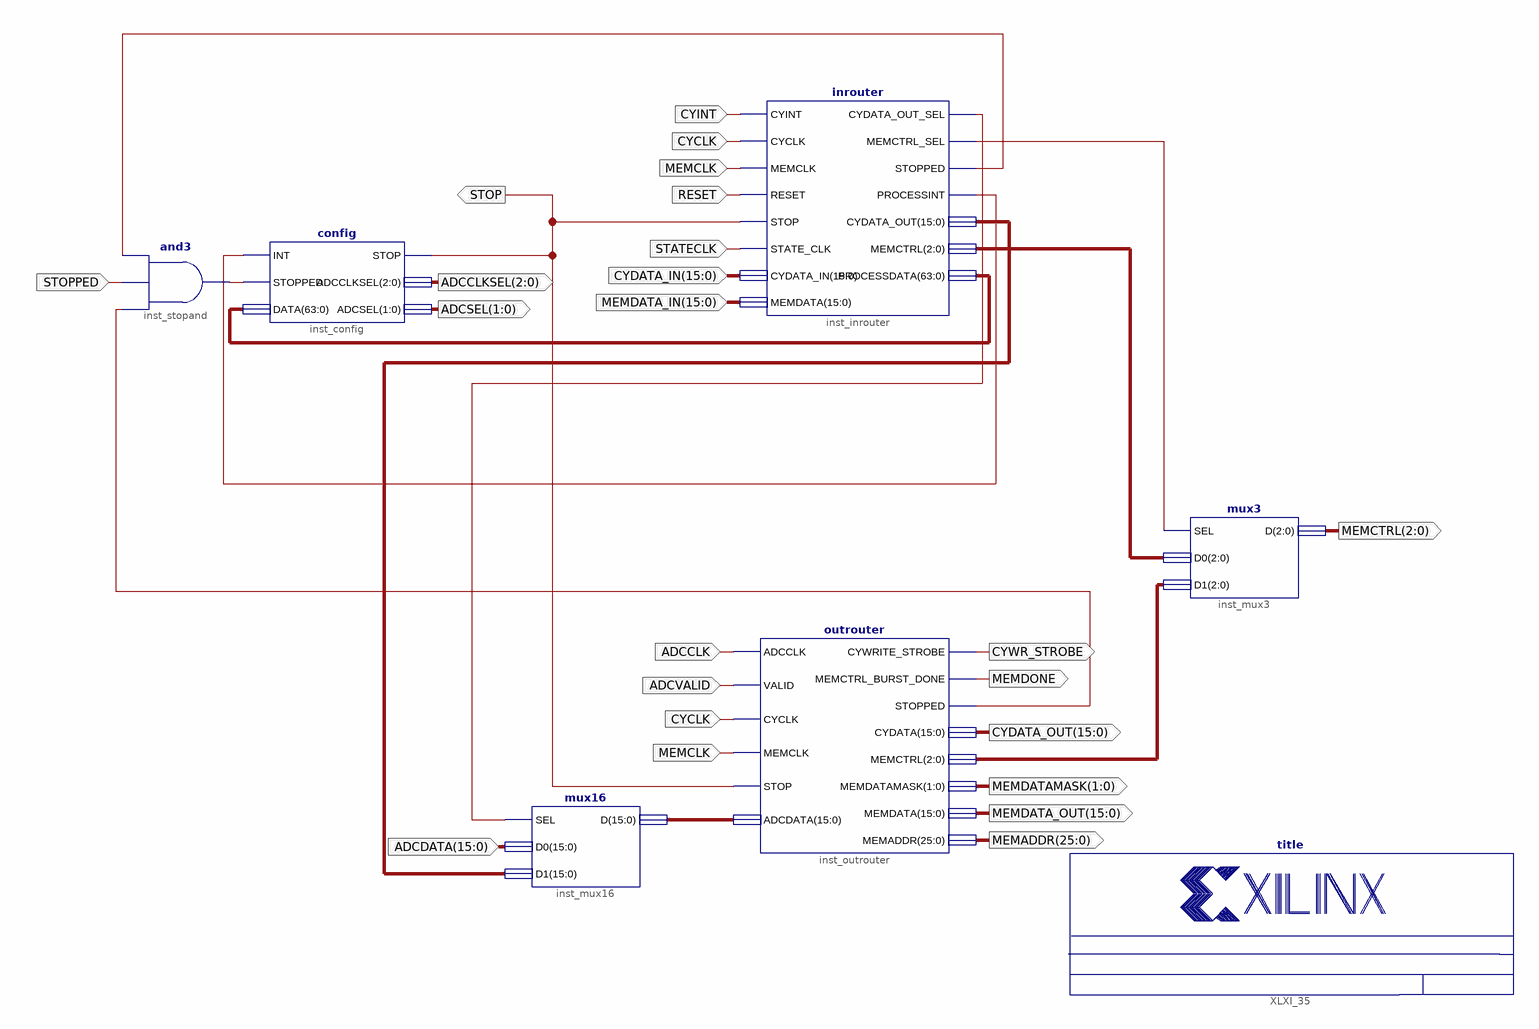
[diagram p0: schematic sheet 1]
// Xilinx ISE schematic processor.sch (spartan3a) as structural Verilog: 7 symbols, 21 ports
module processor (
  input  CYCLK,
  input  STATECLK,
  input  CYINT,
  input  [15:0] MEMDATA_IN,
  input  STOPPED,
  input  [15:0] CYDATA_IN,
  input  ADCCLK,
  input  ADCVALID,
  input  [15:0] ADCDATA,
  input  MEMCLK,
  input  RESET,
  output [1:0] ADCSEL,
  output [2:0] ADCCLKSEL,
  output [2:0] MEMCTRL,
  output STOP,
  output [25:0] MEMADDR,
  output [1:0] MEMDATAMASK,
  output [15:0] MEMDATA_OUT,
  output [15:0] CYDATA_OUT,
  output CYWR_STROBE,
  output MEMDONE
);

  wire XLXN_3, XLXN_22, XLXN_77, XLXN_85, XLXN_193, XLXN_202;
  wire [2:0] XLXN_74, XLXN_75;
  wire [15:0] XLXN_1, XLXN_224;
  wire [63:0] XLXN_223;

  title #(.TitleFieldText("USB Scope"), .NameFieldText("(C) Ali Lown 2010-11")) XLXI_35 ();
  inrouter inst_inrouter (
    .CYINT(CYINT), .CYCLK(CYCLK), .MEMCLK(MEMCLK), .RESET(RESET), .STOP(STOP), .STATE_CLK(STATECLK),
    .CYDATA_IN(CYDATA_IN), .MEMDATA(MEMDATA_IN), .CYDATA_OUT_SEL(XLXN_3), .MEMCTRL_SEL(XLXN_77),
    .STOPPED(XLXN_85), .PROCESSINT(XLXN_193), .CYDATA_OUT(XLXN_224), .MEMCTRL(XLXN_75), .PROCESSDATA(XLXN_223));
  \config  inst_config (
    .INT(XLXN_193), .STOPPED(XLXN_22), .DATA(XLXN_223), .STOP(STOP), .ADCCLKSEL(ADCCLKSEL), .ADCSEL(ADCSEL));
  mux3 inst_mux3 (.SEL(XLXN_77), .D0(XLXN_75), .D1(XLXN_74), .D(MEMCTRL));
  and inst_stopand (XLXN_22, XLXN_202, STOPPED, XLXN_85);
  mux16 inst_mux16 (.SEL(XLXN_3), .D0(ADCDATA), .D1(XLXN_224), .D(XLXN_1));
  outrouter inst_outrouter (
    .ADCCLK(ADCCLK), .VALID(ADCVALID), .CYCLK(CYCLK), .MEMCLK(MEMCLK), .STOP(STOP), .ADCDATA(XLXN_1),
    .CYWRITE_STROBE(CYWR_STROBE), .MEMCTRL_BURST_DONE(MEMDONE), .STOPPED(XLXN_202), .CYDATA(CYDATA_OUT),
    .MEMCTRL(XLXN_74), .MEMDATAMASK(MEMDATAMASK), .MEMDATA(MEMDATA_OUT), .MEMADDR(MEMADDR));
endmodule
